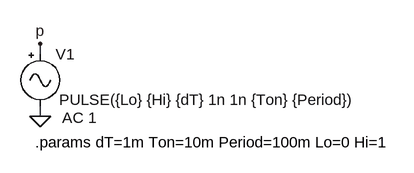
[diagram p0: schematic GenPulseB.asc]
GenPulseB.asc, the LTspice schematic file:
Version 4
SHEET 1 880 680
WIRE 48 96 48 80
WIRE 48 192 48 176
FLAG 48 192 0
FLAG 48 80 p
SYMBOL Misc\\signal 48 80 R0
WINDOW 123 34 114 Left 0
WINDOW 39 0 0 Left 0
WINDOW 3 29 86 Left 0
SYMATTR Value2 AC 1
SYMATTR InstName V1
SYMATTR Value PULSE({Lo} {Hi} {dT} 1n 1n {Ton} {Period})
TEXT 40 232 Left 0 !.params dT=1m Ton=10m Period=100m Lo=0 Hi=1

The netlist it stands for:
* GenPulseB.asc
V1 p 0 PULSE({Lo} {Hi} {dT} 1n 1n {Ton} {Period}) AC 1
.params dT=1m Ton=10m Period=100m Lo=0 Hi=1
.backanno
.end